# EAGLE design Protoboard (EAGLE 9.6.2)
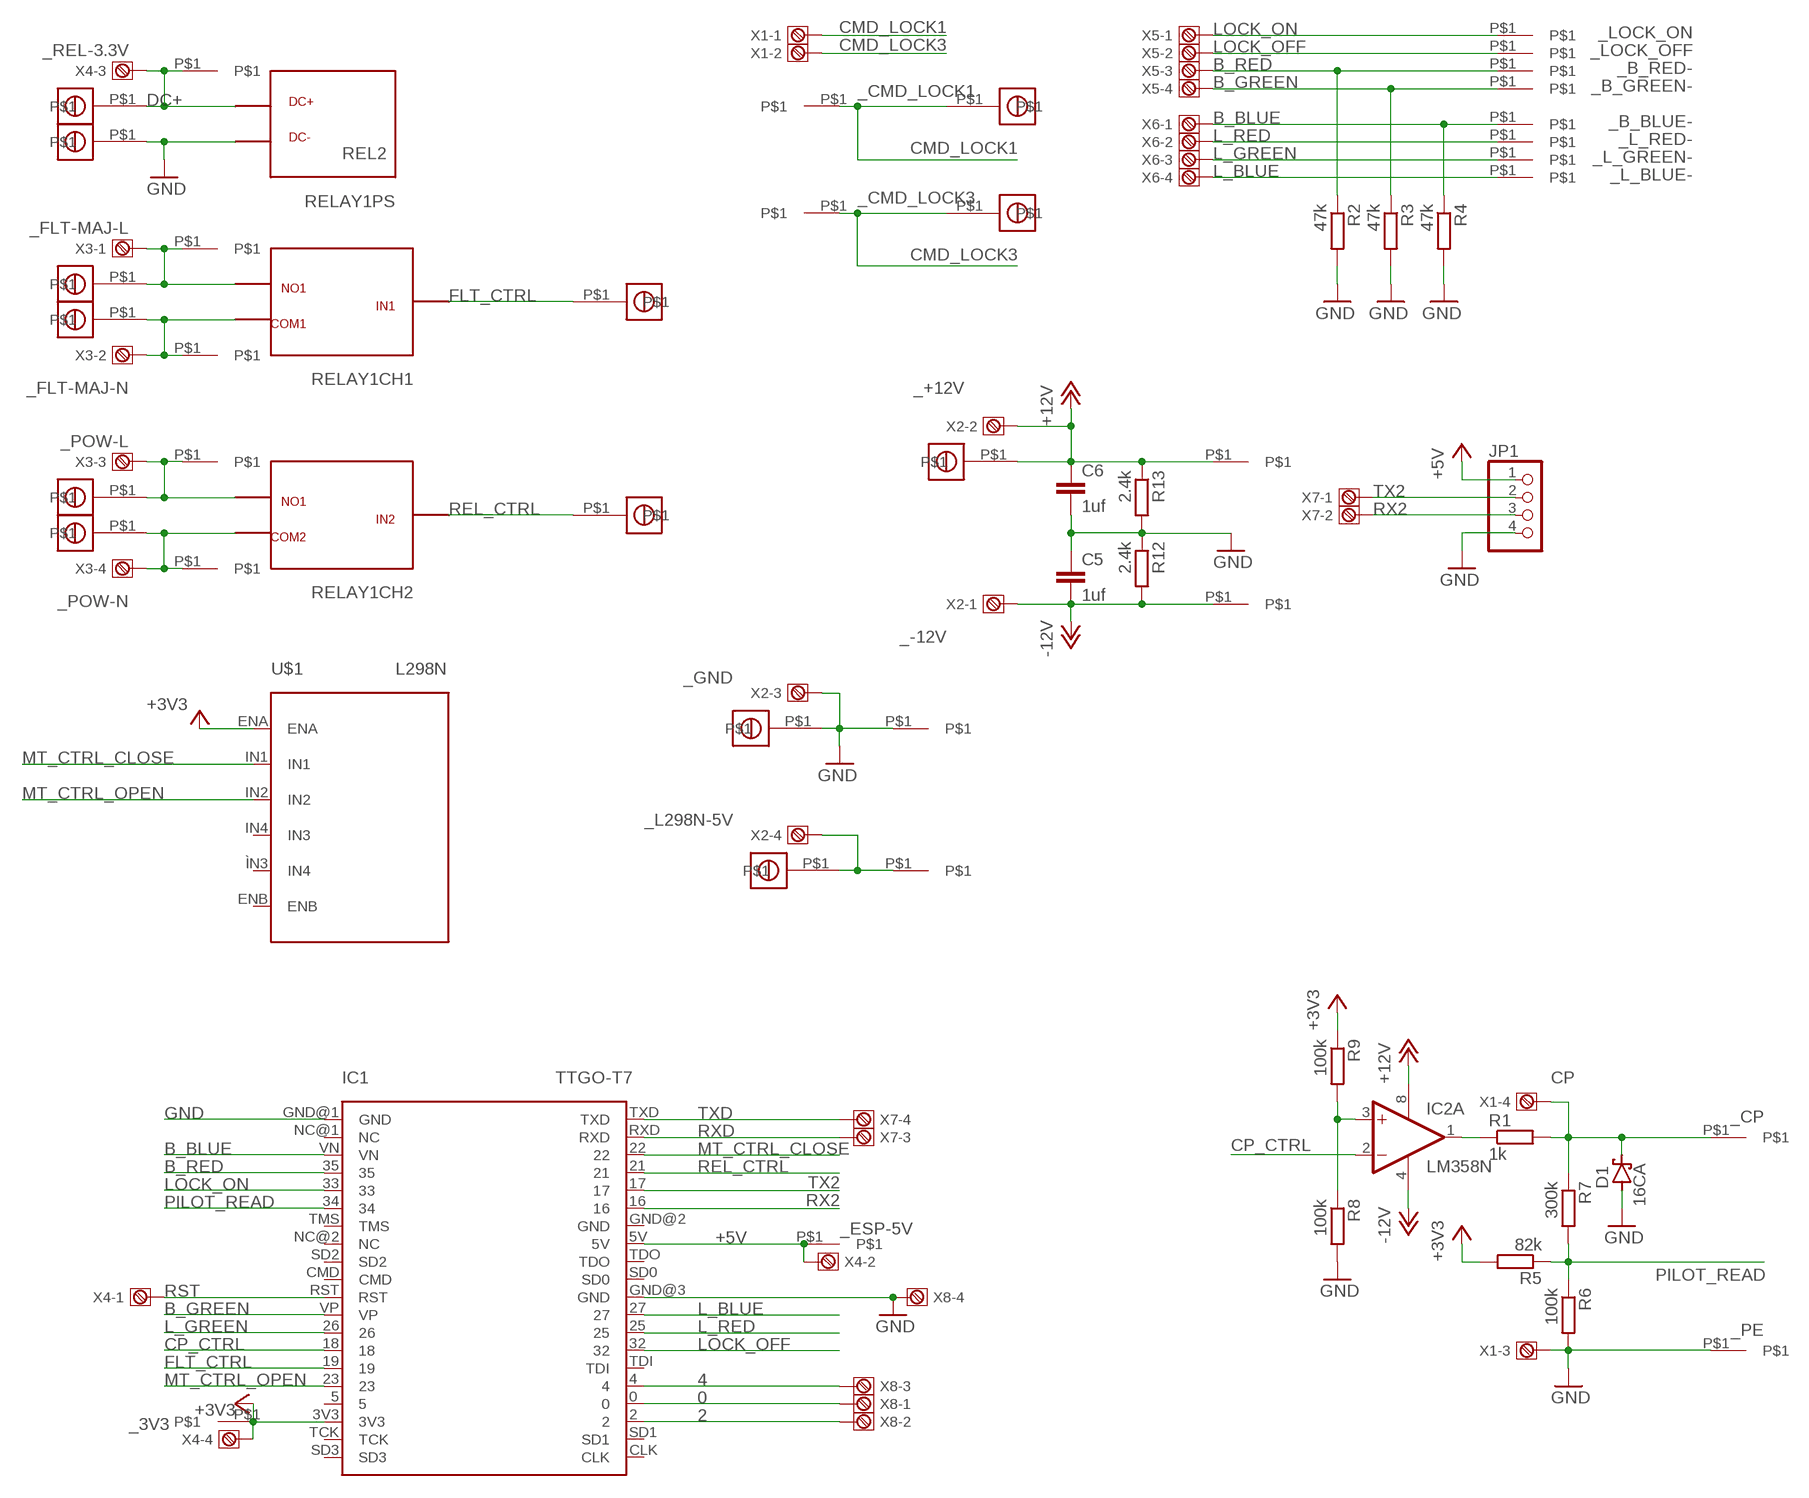
[diagram p0: schematic, sheet 1, part 1 of 2]
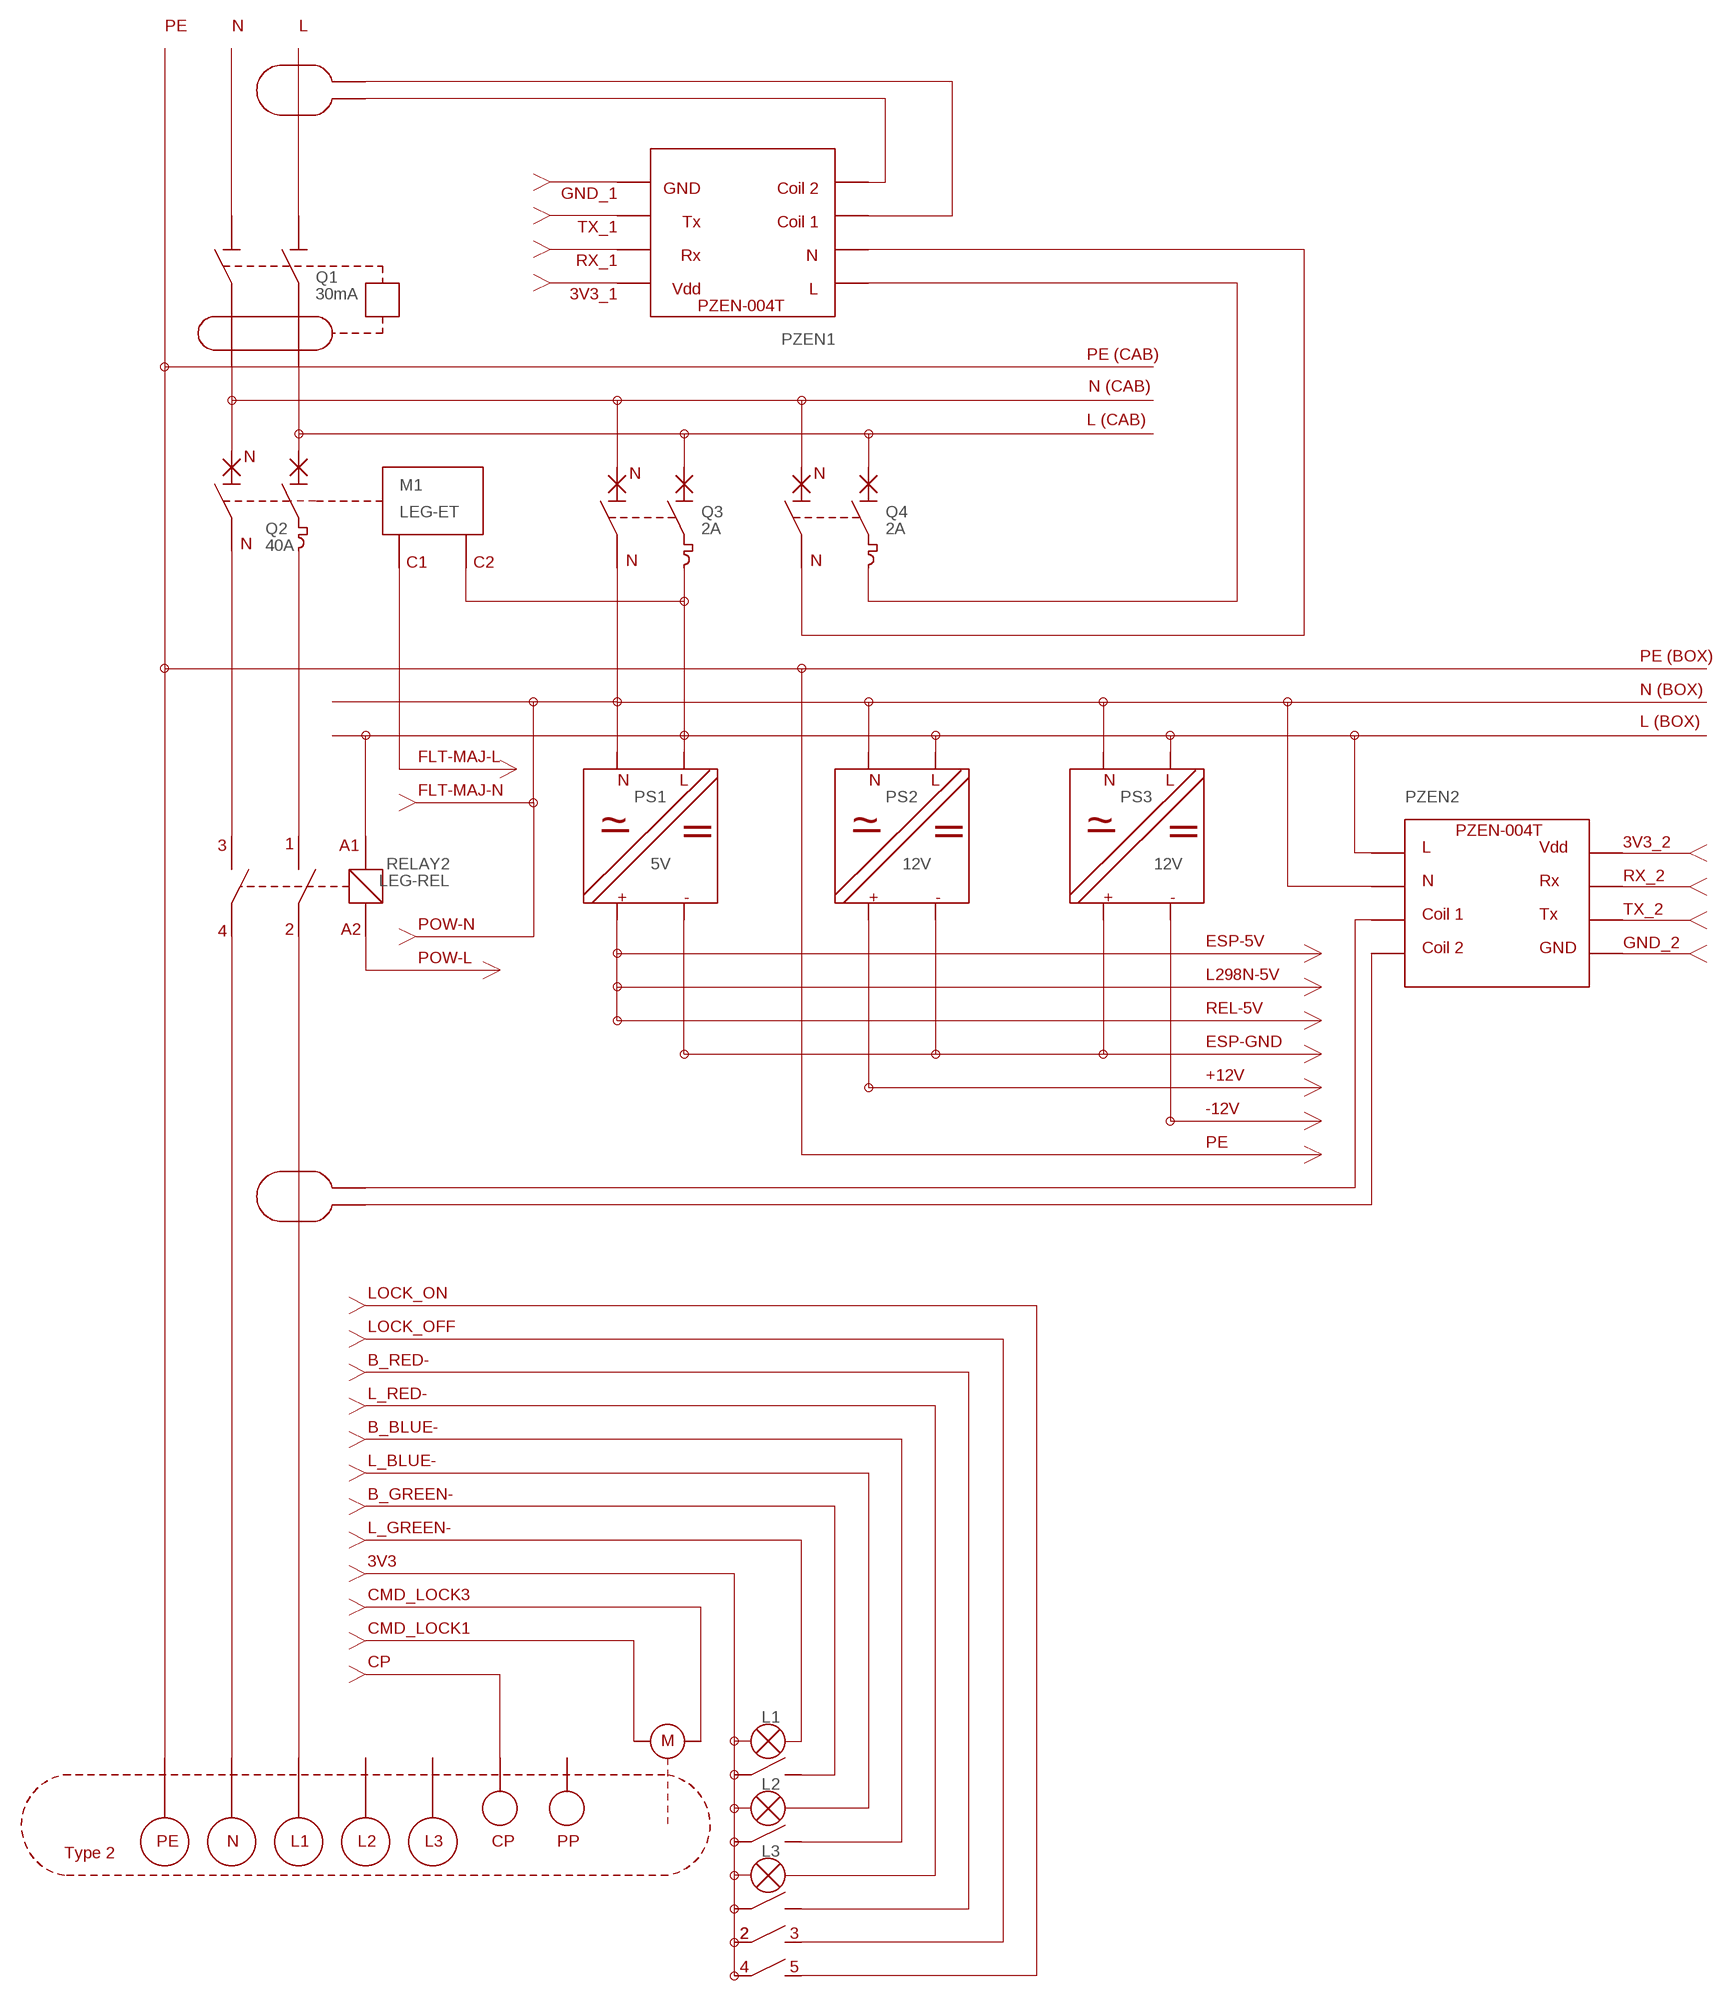
[diagram p1: schematic, sheet 1, part 2 of 2]

## Parts
5V  BORNIER  [BORNIER]
12V  BORNIER  [BORNIER]
_3V3  PIN  [PIN]
_+12V  PIN  [PIN]
_-12V  PIN  [PIN]
_B_BLUE-  PIN  [PIN]
_B_GREEN-  PIN  [PIN]
_B_RED-  PIN  [PIN]
_CMD_LOCK1  PIN  [PIN]
_CMD_LOCK3  PIN  [PIN]
_CP  PIN  [PIN]
_ESP-5V  PIN  [PIN]
_FLT-MAJ-L  PIN  [PIN]
_FLT-MAJ-N  PIN  [PIN]
_GND  PIN  [PIN]
_L298N-5V  PIN  [PIN]
_L_BLUE-  PIN  [PIN]
_L_GREEN-  PIN  [PIN]
_L_RED-  PIN  [PIN]
_LOCK_OFF  PIN  [PIN]
_LOCK_ON  PIN  [PIN]
_PE  PIN  [PIN]
_POW-L  PIN  [PIN]
_POW-N  PIN  [PIN]
_REL-3.3V  PIN  [PIN]
C5  1uf  C-EU050-025X075  [C050-025X075]
C6  1uf  C-EU050-025X075  [C050-025X075]
D1  16CA  P6KEXXA  [C1702-15]
DC+  BORNIER  [BORNIER]
DC-  BORNIER  [BORNIER]
FLT-L  BORNIER  [BORNIER]
FLT-N  BORNIER  [BORNIER]
GND  BORNIER  [BORNIER]
IC1  TTGO-T7  [TTGO-T7]
IC2  LM358N  [DIL08]
IN1  BORNIER  [BORNIER]
IN2  BORNIER  [BORNIER]
JP1  PINHD-1X4  [1X04]
MT1  BORNIER  [BORNIER]
MT2  BORNIER  [BORNIER]
POW-L  BORNIER  [BORNIER]
POW-N  BORNIER  [BORNIER]
R1  1k  R-EU_0207/10  [0207/10]
R2  47k  R-EU_0207/10  [0207/10]
R3  47k  R-EU_0207/10  [0207/10]
R4  47k  R-EU_0207/10  [0207/10]
R5  82k  R-EU_0207/10  [0207/10]
R6  100k  R-EU_0207/10  [0207/10]
R7  300k  R-EU_0207/10  [0207/10]
R8  100k  R-EU_0207/10  [0207/10]
R9  100k  R-EU_0207/10  [0207/10]
R12  2.4k  R-EU_0207/10  [0207/10]
R13  2.4k  R-EU_0207/10  [0207/10]
RELAY1  REL2  [REL2]
U$1  L298N  [L298N]
X1  1727036  [1727036]
X2  1727036  [1727036]
X3  1727036  [1727036]
X4  1727036  [1727036]
X5  1727036  [1727036]
X6  1727036  [1727036]
X7  1727036  [1727036]
X8  1727036  [1727036]

## Nets
0: IC1.0 X8.1
2: IC1.2 X8.2
4: IC1.4 X8.3
+3V3: _3V3.P$1 IC1.3V3 R5.2 R9.1 U$1.ENA X4.4
+5V: _ESP-5V.P$1 IC1.5V JP1.1 X4.2
+12V: 12V.P$1 _+12V.P$1 C6.1 IC2.8(P:V+) R13.1 X2.2
-12V: _-12V.P$1 C5.2 IC2.4(P:V-) R12.2 X2.1
B_BLUE: _B_BLUE-.P$1 IC1.VN R4.1 X6.1
B_GREEN: _B_GREEN-.P$1 IC1.VP R3.1 X5.4
B_RED: _B_RED-.P$1 IC1.35 R2.1 X5.3
CMD_LOCK1: _CMD_LOCK1.P$1 MT2.P$1 X1.2
CMD_LOCK3: _CMD_LOCK3.P$1 MT1.P$1 X1.1
CP: _CP.P$1 D1.C R1.2 R7.1 X1.4
CP_CTRL: IC1.18 IC2.2(A:-IN)
DC+: _REL-3.3V.P$1 DC+.P$1 X4.3
FLT_CTRL: IC1.19 IN1.P$1
GND: _GND.P$1 _PE.P$1 C5.1 C6.2 D1.A DC-.P$1 GND.P$1 IC1.GND@1(GND) IC1.GND@3(GND) JP1.4 R2.2 R3.2 R4.2 R6.2 R8.2 R12.1 R13.2 X1.3 X2.3 X8.4
L_BLUE: _L_BLUE-.P$1 IC1.27 X6.4
L_GREEN: _L_GREEN-.P$1 IC1.26 X6.3
L_RED: _L_RED-.P$1 IC1.25 X6.2
LOCK_OFF: _LOCK_OFF.P$1 IC1.32 X5.2
LOCK_ON: _LOCK_ON.P$1 IC1.33 X5.1
MT_CTRL_CLOSE: IC1.22 U$1.IN1
MT_CTRL_OPEN: IC1.23 U$1.IN2
N$1: _FLT-MAJ-N.P$1 FLT-N.P$1 X3.2
N$3: _FLT-MAJ-L.P$1 FLT-L.P$1 X3.1
N$4: IC2.1(A:OUT) R1.1
N$5: _POW-L.P$1 POW-L.P$1 X3.3
N$6: _POW-N.P$1 POW-N.P$1 X3.4
N$14: IC2.3(A:+IN) R8.1 R9.2
N$16: 5V.P$1 _L298N-5V.P$1 X2.4
PILOT_READ: IC1.34 R5.1 R6.1 R7.2
REL_CTRL: IC1.21 IN2.P$1
RST: IC1.RST X4.1
RX2: IC1.16 JP1.3 X7.2
RXD: IC1.RXD X7.3
TX2: IC1.17 JP1.2 X7.1
TXD: IC1.TXD X7.4
Unconnected: IC1.5 IC1.CLK IC1.CMD IC1.GND@2(GND) IC1.NC@1(NC) IC1.NC@2(NC) IC1.SD0 IC1.SD1 IC1.SD2 IC1.SD3 IC1.TCK IC1.TDI IC1.TDO IC1.TMS IC2.5(B:+IN) IC2.6(B:-IN) IC2.7(B:OUT) U$1.ENB U$1.IN4(IN3) U$1.ÌN3(IN4)

## Notes on the sheet
- PE | N | L
- GND_1
- TX_1
- RX_1
- 3V3_1
- PE (CAB)
- N (CAB)
- L (CAB)
- PE (BOX)
- N (BOX)
- L (BOX)
- FLT-MAJ-L
- FLT-MAJ-N
- 3V3_2
- RX_2
- TX_2
- POW-N
- ESP-5V | GND_2
- POW-L
- L298N-5V
- REL-5V
- ESP-GND
- +12V
- -12V
- PE
- LOCK_ON
- LOCK_OFF
- B_RED-
- L_RED-
- B_BLUE-
- L_BLUE-
- B_GREEN-
- L_GREEN-
- 3V3
- CMD_LOCK3
- CMD_LOCK1
- CP
- 2 | 2 | 3
- 4 | 5

## Library data of the parts
5V 12V DC+ DC- FLT-L FLT-N GND IN1 IN2 MT1 MT2 POW-L POW-N = bornier:BORNIER
_3V3 _+12V _-12V _B_BLUE- _B_GREEN- _B_RED- _CMD_LOCK1 _CMD_LOCK3 _CP _ESP-5V _FLT-MAJ-L _FLT-MAJ-N _GND _L298N-5V _L_BLUE- _L_GREEN- _L_RED- _LOCK_OFF _LOCK_ON _PE _POW-L _POW-N _REL-3.3V = PIN:PIN
C5 C6 = rcl:C-EU: CAPACITOR, European symbol; SPICEPREFIX: C
D1 = diode:P6KEXXA: DIODE transient-voltage suppressor
IC1 = TTGO T7:TTGO-T7: TTGO-T7 V1.4
IC2 = linear:LM358: OP AMP also LM158; LM258; LM2904 Source: http://cache.national.com/ds/LM/LM158.pdf
JP1 = pinhead:PINHD-1X4: PIN HEADER
R1-R9 R12 R13 = rcl:R-EU_: RESISTOR, European symbol; SPICEPREFIX: R
RELAY1 = REL2:REL2: REL2
U$1 = L298N:L298N: L298N
X1-X8 = con-phoenix-3.81:1727036: MKDS 1/4-3,81 Source: http://eshop.phoenixcontact.de; MF: FARNELL; MPN: 1727036; OC_FARNELL: 3704592; OC_NEWARK: 71C4114

## Board
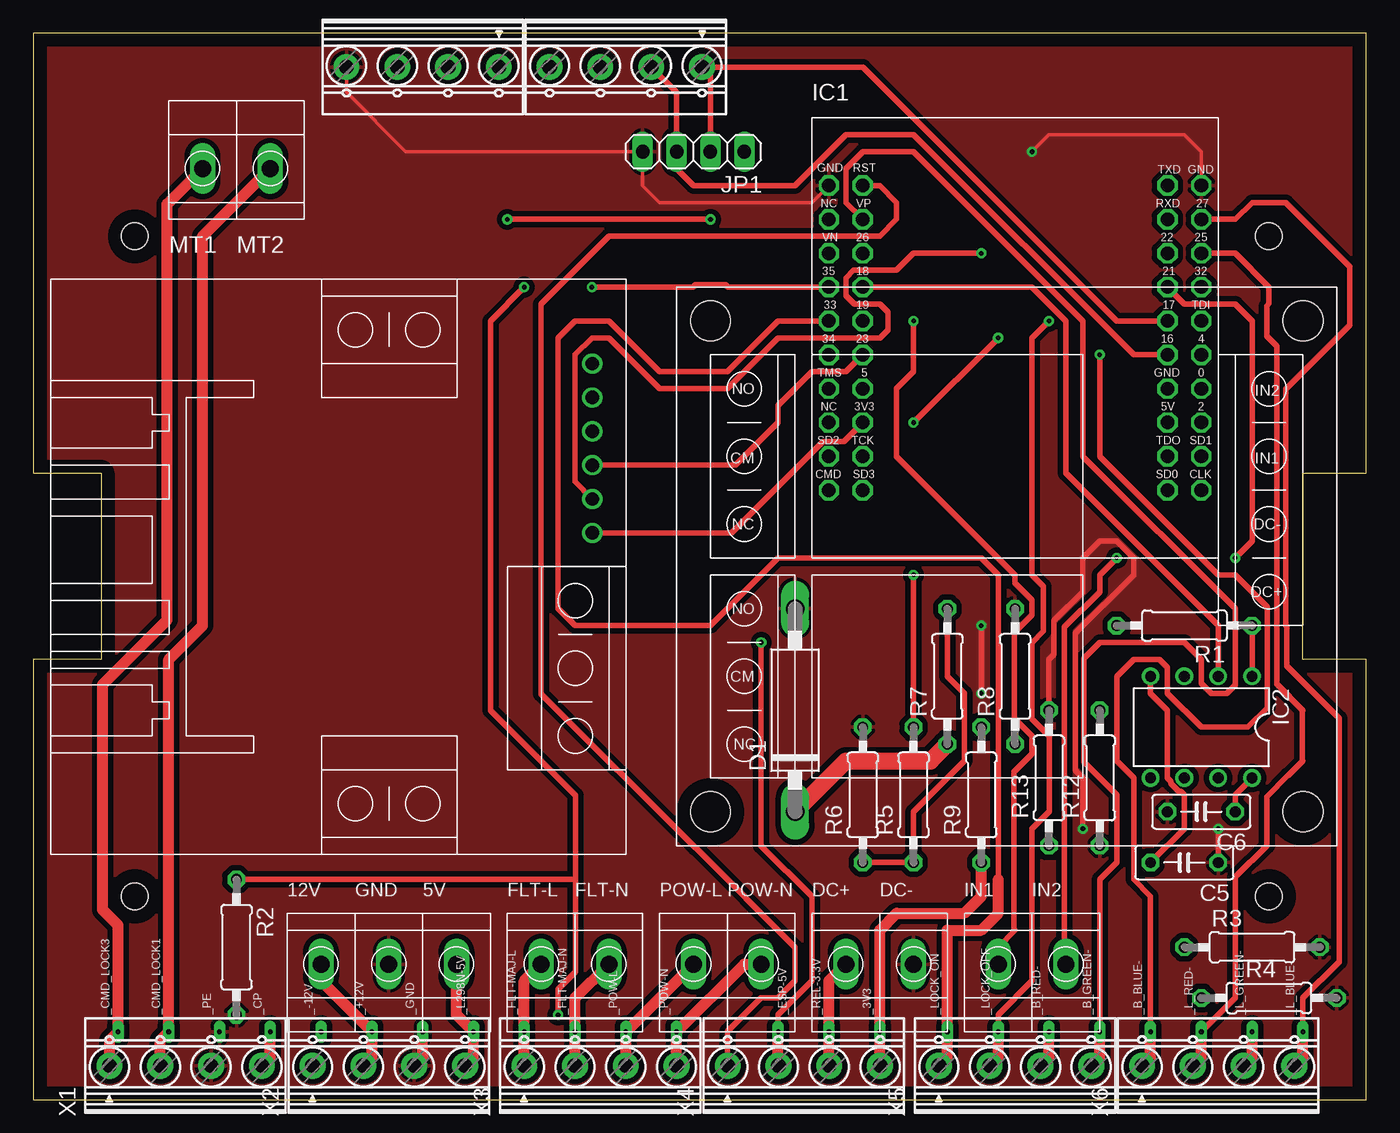
[diagram p2: board, top side]
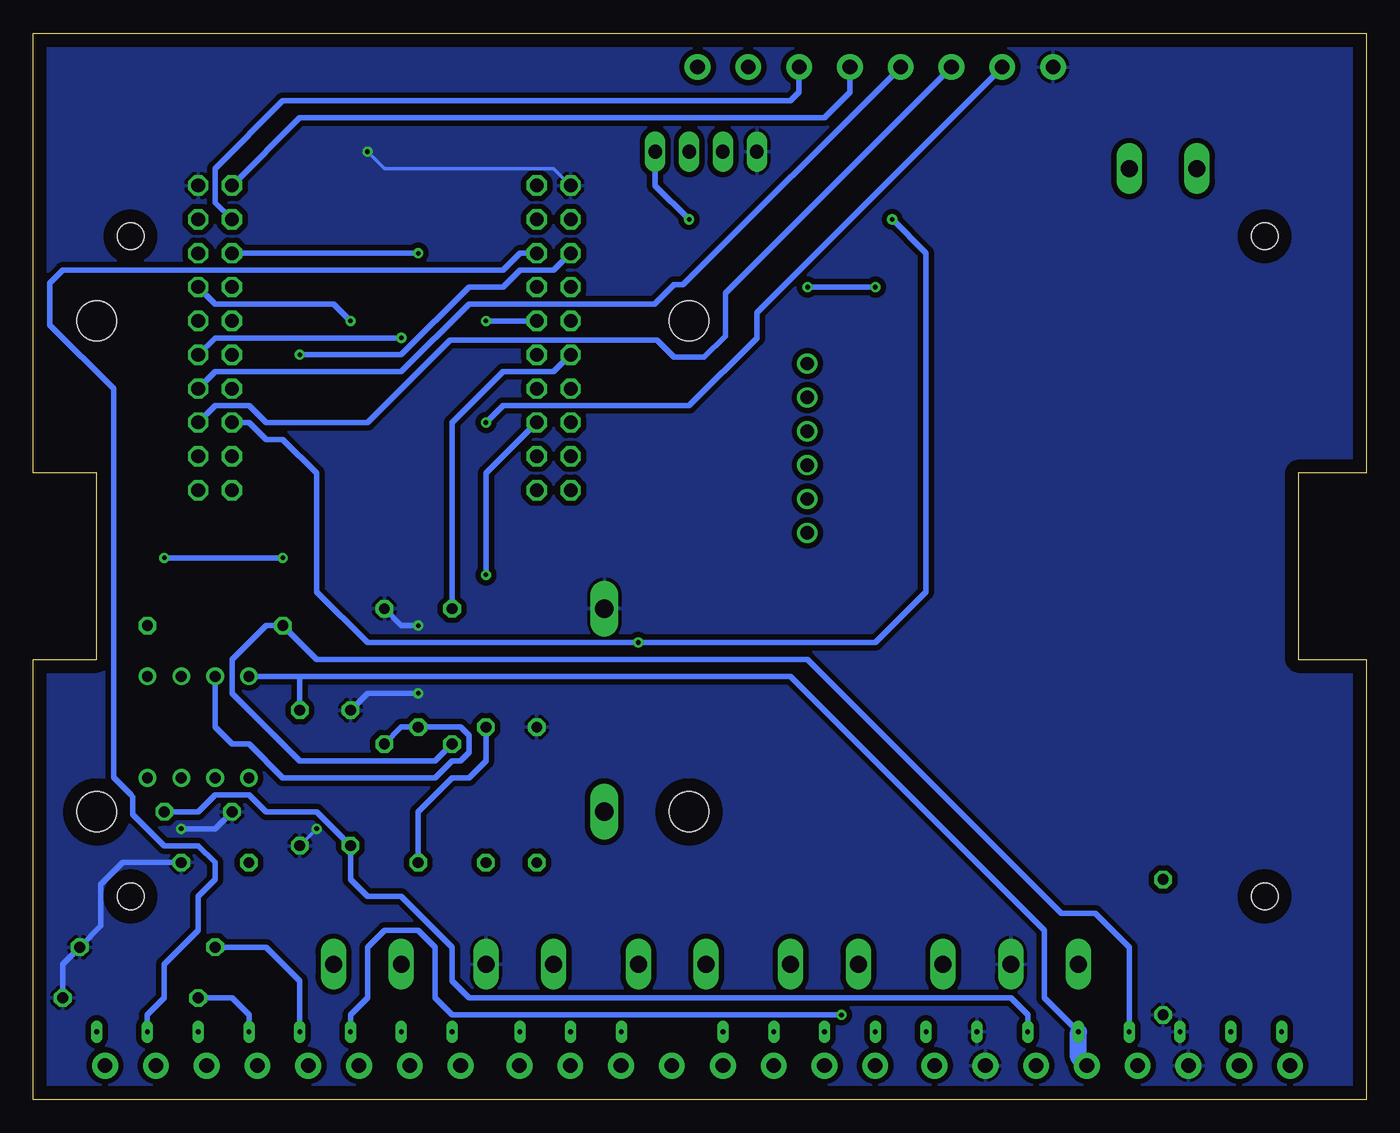
[diagram p3: board, bottom side, seen from below]

Size 100 x 80 mm. Coordinates in mm from the lower left corner, seen from the top.
Outline: 100,80 100,46.99 95.25,46.99 95.25,33.02 100,33.02 100,0 0,0 0,33.02 5.08,33.02 5.08,46.99 0,46.99 0,80 100,80
Outline: 100,80 100,80
Copper layers (1*16): Top 0.035mm / dielectric 1.5mm / Bottom 0.035mm
Design rules "default": minimum track width 6mil, minimum drill 0.35mm, track to track 6mil, track to pad 6mil, pad to pad 6mil, via to via 6mil, smd to smd 6mil, copper to edge 40mil, drill to drill 6mil, minimum pad ring 10mil, minimum via ring 8mil, stop-mask expansion 4mil, vias tented up to drill 0mil, thermal gap 10mil
Holes 2 mm at 7.62,15.24 92.71,15.24 7.62,64.77 92.71,64.77

### Footprints (pad centres in the part's own frame; a part is rotated, then mirrored left to right if it is on the bottom)
BORNIER = drill 1.27 long: P$1 0,0
PIN = drill 0.35 long: P$1 0,0
C050-025X075 = drill 0.813 octagon: 1 -2.54,0; 2 2.54,0
C1702-15 = drill 1.397 long: A 7.62,0; C -7.62,0
TTGO-T7 = drill 1.016 pad 1.524 octagon: 0 27.94,7.62; 2 27.94,5.08; 3V3 2.54,5.08; 4 27.94,10.16; 5 2.54,7.62; 5V 25.4,5.08; 16 25.4,10.16; 17 25.4,12.7; 18 2.54,15.24; 19 2.54,12.7; 21 25.4,15.24; 22 25.4,17.78; 23 2.54,10.16; 25 27.94,17.78; 26 2.54,17.78; 27 27.94,20.32; 32 27.94,15.24; 33 0,12.7; 34 0,10.16; 35 0,15.24; CLK 27.94,0; CMD 0,0; GND@1 0,22.86; GND@2 25.4,7.62; GND@3 27.94,22.86; NC@1 0,20.32; NC@2 0,5.08; RST 2.54,22.86; RXD 25.4,20.32; SD0 25.4,0; SD1 27.94,2.54; SD2 0,2.54; SD3 2.54,0; TCK 2.54,2.54; TDI 27.94,12.7; TDO 25.4,2.54; TMS 0,7.62; TXD 25.4,22.86; VN 0,17.78; VP 2.54,20.32
DIL08 = drill 0.813 pad 1.27: 1 -3.81,-3.81; 2 -1.27,-3.81; 3 1.27,-3.81; 4 3.81,-3.81; 5 3.81,3.81; 6 1.27,3.81; 7 -1.27,3.81; 8 -3.81,3.81
1X04 = drill 1.016 long: 1 -3.81,0; 2 -1.27,0; 3 1.27,0; 4 3.81,0
0207/10 = drill 0.813 octagon: 1 -5.08,0; 2 5.08,0
REL2 = hole 3: 46.99,2.54; 46.99,39.37; 2.54,39.37; 2.54,2.54
L298N = drill 1: ENA 2.54,19.05; ENB 2.54,6.35; IN1 2.54,16.51; IN2 2.54,13.97; IN4 2.54,8.89; ÌN3 2.54,11.43
1727036 = drill 1.1 pad 1.93: 1 -5.715,0; 2 -1.905,0; 3 1.905,0; 4 5.715,0

### Placement (x,y rotation side)
5V  31.75,10.16 180 top
12V  21.59,10.16 180 top
_3V3  63.5,5.08 90 top
_+12V  25.4,5.08 90 top
_-12V  21.59,5.08 90 top
_B_BLUE-  83.82,5.08 90 top
_B_GREEN-  80.01,5.08 90 top
_B_RED-  76.2,5.08 90 top
_CMD_LOCK1  10.16,5.08 90 top
_CMD_LOCK3  6.35,5.08 90 top
_CP  17.78,5.08 90 top
_ESP-5V  55.88,5.08 90 top
_FLT-MAJ-L  36.83,5.08 90 top
_FLT-MAJ-N  40.64,5.08 90 top
_GND  29.21,5.08 90 top
_L298N-5V  33.02,5.08 90 top
_L_BLUE-  95.25,5.08 90 top
_L_GREEN-  91.44,5.08 90 top
_L_RED-  87.63,5.08 90 top
_LOCK_OFF  72.39,5.08 90 top
_LOCK_ON  68.58,5.08 90 top
_PE  13.97,5.08 90 top
_POW-L  44.45,5.08 90 top
_POW-N  48.26,5.08 90 top
_REL-3.3V  59.69,5.08 90 top
C5  86.36,17.78 180 top
C6  87.63,21.59 180 top
D1  57.15,29.21 90 top
DC+  60.96,10.16 180 top
DC-  66.04,10.16 180 top
FLT-L  38.1,10.16 180 top
FLT-N  43.18,10.16 180 top
GND  26.67,10.16 180 top
IC1  59.69,45.72 0 top
IC2  87.63,27.94 180 top
IN1  72.39,10.16 180 top
IN2  77.47,10.16 180 top
JP1  49.53,71.12 180 top
MT1  12.7,69.85 0 top
MT2  17.78,69.85 0 top
POW-L  49.53,10.16 180 top
POW-N  54.61,10.16 180 top
R1  86.36,35.56 180 top
R2  15.24,11.43 270 top
R3  91.44,11.43 0 top
R4  92.71,7.62 0 top
R5  66.04,22.86 90 top
R6  62.23,22.86 90 top
R7  68.58,31.75 90 top
R8  73.66,31.75 90 top
R9  71.12,22.86 90 top
R12  80.01,24.13 90 top
R13  76.2,24.13 90 top
RELAY1  97.79,60.96 180 top
U$1  44.48,61.57 180 top
X1  11.43,2.54 0 top
X2  26.67,2.54 0 top
X3  42.55,2.54 0 top
X4  57.81,2.54 0 top
X5  73.66,2.54 0 top
X6  88.9,2.54 0 top
X7  44.45,77.47 180 top
X8  29.21,77.47 180 top

### Tracks (layer width: path | path; a pad name or v marks a point on that pad's centre or on a via)
0
  Bottom 0.406: X8.1 51.26,61.14 51.93,61.14 53.38,59.69 67.31,59.69 72.39,54.61 86.36,54.61 IC1.0
2
  Bottom 0.406: X8.2 48.08,60.5 48.08,57.29 49.67,55.7 51.93,55.7 53.22,57 68.73,57 74.93,50.8 82.55,50.8 83.82,52.07 86.36,52.07 IC1.2
4  (via drill 0.35)
  Top 0.406: v66.04,50.8 v72.39,57.15
  Bottom 0.406: X8.3 45.72,59.05 45.72,57.15 50.8,52.07 64.77,52.07 v66.04,50.8 | IC1.4 86.36,57.15 v72.39,57.15
+3V3  (via drill 0.35)
  Top 0.406: IC1.3V3 60.81,49.38 59.23,49.38 52.37,42.52 U$1.ENA | R5.2 v66.04,39.37
  Top 0.813: X4.4 63.5,2.56 _3V3.P$1 63.5,12.7 64.77,13.97 69.85,13.97 71.12,15.24 R9.1
  Bottom 0.406: R5.2 66.04,25.4 67.31,24.13 68.58,24.13 71.12,21.59 R9.1 | IC1.3V3 66.04,46.99 v66.04,39.37
+5V  (via drill 0.35)
  Top 0.406: _ESP-5V.P$1 55.88,6.35 58.42,8.89 58.42,15.24 54.61,19.05 v54.61,34.29 | v50.8,66.04 v35.56,66.04
  Top 0.813: 55.88,2.56 _ESP-5V.P$1
  Top 1.27: X4.2 55.88,2.56
  Bottom 0.406: IC1.5V 83.82,50.8 82.55,49.53 81.28,49.53 78.74,46.99 78.74,38.1 74.93,34.29 v54.61,34.29 36.83,34.29 33.02,38.1 33.02,63.5 v35.56,66.04 | JP1.1 53.34,68.58 v50.8,66.04
+12V
  Top 0.406: C6.1 90.17,22.86 IC2.8
  Top 0.813: X2.2 25.4,3.17 _+12V.P$1 21.59,8.89 12V.P$1
  Bottom 0.406: _+12V.P$1 25.4,6.35 26.67,7.62 67.31,7.62 68.58,8.89 68.58,11.43 72.39,15.24 74.93,15.24 76.2,16.51 R13.1 78.74,21.59 82.55,21.59 83.82,22.86 86.36,22.86 87.63,21.59 C6.1
-12V
  Top 0.406: IC2.4 83.82,30.48 85.09,29.21 85.09,24.13 85.34,23.88 85.34,23.71 85.94,23.11 86.11,23.11 86.36,22.86 86.36,20.32 C5.2
  Bottom 0.406: _-12V.P$1 24.13,7.62 24.13,12.7 43.18,31.75 80.01,31.75 | 80.01,31.75 IC2.4 | R12.2 80.01,31.75
  Bottom 1.27: X2.1 21.59,3.17 _-12V.P$1
B_BLUE  (via drill 0.35)
  Top 0.406: _B_BLUE-.P$1 83.82,15.24 82.55,16.51 82.55,24.13 81.28,25.4 81.28,31.75 82.55,33.02 84.48,33.02 85.09,32.41 85.09,30.48 87.63,27.94 91.14,27.94 92.58,29.39 92.58,36.96 90.17,39.37 88.9,39.37 80.01,48.26 v80.01,55.88
  Top 0.813: X6.1 83.82,3.17 _B_BLUE-.P$1
  Bottom 0.406: v80.01,55.88 72.39,55.88 67.31,60.96 64.77,60.96 63.5,62.23 60.96,62.23 IC1.VN | R4.1 85.09,7.62 83.82,6.35 _B_BLUE-.P$1
B_GREEN
  Top 0.406: _B_GREEN-.P$1 80.01,16.51 81.28,17.78 81.28,22.86 78.82,25.32 78.82,33.1 80.01,34.29 86.36,34.29 87.63,33.02 87.63,31.22 88.37,30.48 89.56,30.48 90.17,31.09 90.17,36.83 78.74,48.26 78.74,58.42 66.04,71.12 62.23,71.12 60.96,69.85 60.96,67.31 IC1.VP
  Top 0.813: X5.4 80.01,3.17 _B_GREEN-.P$1
  Bottom 0.406: R3.1 82.55,11.43 80.01,8.89 _B_GREEN-.P$1
B_RED  (via drill 0.35)
  Top 0.406: IC1.35 52.11,60.96 51.93,61.14 49.67,61.14 49.49,60.96 v41.91,60.96 | 40.66,16.51 40.66,9.58 39.37,8.28 v39.37,6.35 | 40.66,16.51 40.66,22.84 34.29,29.21 34.29,58.42 v36.83,60.96 | R2.1 40.66,16.51
  Top 0.813: X5.3 76.2,3.17 _B_RED-.P$1
  Bottom 0.406: _B_RED-.P$1 76.2,6.35 74.93,7.62 74.93,11.43 73.66,12.7 71.12,12.7 69.85,11.43 69.85,7.62 68.58,6.35 v39.37,6.35 | v41.91,60.96 v36.83,60.96
CMD_LOCK1
  Top 0.813: X1.2 9.53,4.45 _CMD_LOCK1.P$1 10.16,33.02 12.7,35.56 12.7,64.77 MT2.P$1
CMD_LOCK3
  Top 0.813: X1.1 5.71,4.45 _CMD_LOCK3.P$1 6.35,13.09 5.2,14.24 5.2,31.13 10.04,35.97 10.04,67.19 MT1.P$1
CP
  Top 0.813: X1.4 17.78,3.17 _CP.P$1
  Top 1.27: D1.C 60.96,25.4 67.31,25.4 R7.1
  Bottom 0.406: _CP.P$1 17.78,11.43 20.32,13.97 22.86,13.97 41.91,33.02 78.74,33.02 R1.2 82.55,35.56 85.09,33.02 85.09,30.48 80.01,25.4 69.85,25.4 R7.1
CP_CTRL
  Top 0.406: IC2.2 88.9,35.56 77.47,46.99 77.47,58.42 74.93,60.96 IC1.18
DC+
  Top 0.813: X4.3 59.69,2.56 _REL-3.3V.P$1 59.69,8.89 DC+.P$1
FLT_CTRL  (via drill 0.35)
  Top 0.406: v66.04,58.42 66.04,54.61 64.77,53.34 64.77,48.26 73.66,39.37 73.66,38.76 74.93,37.49 74.93,36.35 73.66,35.08 73.61,35.08 73.61,28.6 74.93,27.28 74.93,25.93 73.58,24.59 73.58,12.78 73.66,12.7 72.39,11.43 IN1.P$1
  Bottom 0.406: IC1.19 v66.04,58.42
GND  (via drill 0.35)
  Top 0.254: IC1.GND@1 58.42,67.31 46.99,67.31 45.72,68.58 JP1.4 27.94,71.12 23.5,75.56 X8.4 | IC1.GND@3 87.63,71.12 86.36,72.39 76.2,72.39 v74.93,71.12
  Top 0.406: v71.12,35.56 v71.12,30.48 | v78.74,20.32 78.74,24.13 78.18,24.69 78.18,35 82.55,39.37 82.55,40.64 81.28,41.91 80.01,41.91 78.74,40.64 78.74,38.1 76.58,35.94 76.58,33.4 76.2,33.02 R13.2 | v88.9,20.32 C5.1
  Top 0.813: X2.3 29.21,3.17 _GND.P$1
  Bottom 0.254: v74.93,71.12 73.66,69.85 60.96,69.85 IC1.GND@1 | R12.1 v78.74,20.32
  Bottom 0.406: R8.2 72.39,35.56 v71.12,35.56 | v71.12,30.48 74.93,30.48 R13.2 | R4.2 97.79,10.16 R3.2 94.93,13.02 94.93,16.16 93.31,17.78 C5.1 | C6.2 86.36,20.32 v88.9,20.32
  pour Top (isolate 0.406): 0,0 0,33.02 5.08,33.02 5.08,46.99 0,46.99 0,80.01 100,80.01 100,47.02 99.97,46.99 95.25,46.99 95.25,33.02 100,33.02 100,0
  pour Bottom (isolate 0.406): 0,0 0,33.02 5.08,33.02 5.08,46.99 0,46.99 0,80.01 100,80.01 100,46.99 95.25,46.99 95.25,33.02 100,33.02 100,0
L_BLUE
  Top 0.406: IC1.27 90.17,66.04 91.44,67.31 93.98,67.31 98.78,62.51 98.78,58.1 93.98,53.3 93.98,35.56 94.03,35.51 94.03,32.52 97.97,28.58 97.97,10.34 95.25,7.62 _L_BLUE-.P$1
  Top 0.813: X6.4 95.25,3.17 _L_BLUE-.P$1
L_GREEN
  Top 0.813: X6.3 91.44,3.17 _L_GREEN-.P$1
  Bottom 0.406: IC1.26 63.5,63.5 64.77,62.23 97.79,62.23 98.78,61.24 98.78,58.1 96.38,55.7 96.34,55.7 93.98,53.34 93.98,24.17 92.69,22.88 92.53,22.72 92.53,21.41 90.17,19.05 87.63,19.05 86.36,17.78 86.36,16.51 87.63,15.24 87.63,12.7 90.17,10.16 90.17,7.62 91.44,6.35 _L_GREEN-.P$1
L_RED
  Top 0.406: IC1.25 90.17,63.5 92.71,60.96 92.71,59.73 92.53,59.55 92.53,57.29 93.29,56.53 93.29,31.17 95.25,29.21 95.21,29.17 95.21,25.4 95.25,25.4 94.16,24.31 94.12,24.31 92.53,22.72 92.53,19.05 90.17,16.69 90.17,7.62 _L_RED-.P$1
  Top 0.813: X6.2 87.63,3.17 _L_RED-.P$1
LOCK_OFF  (via drill 0.35)
  Top 0.406: _LOCK_OFF.P$1 72.39,6.35 74.93,8.89 74.93,20.32 76.22,21.61 76.22,27.23 74.91,28.55 74.91,34.27 75.79,35.15 75.79,38.51 74.93,39.37 74.93,57.15 v76.2,58.42
  Top 0.813: X5.2 72.39,3.17 _LOCK_OFF.P$1
  Bottom 0.406: v76.2,58.42 77.47,59.69 86.36,59.69 IC1.32
LOCK_ON
  Top 0.406: 72.39,16.51 72.39,39.37 71.12,40.64 55.88,40.64 50.8,35.56 40.64,35.56 39.37,36.83 39.37,57.15 40.64,58.42 43.18,58.42 46.99,54.61 52.07,54.61 55.88,58.42 IC1.33
  Top 0.813: X5.1 68.58,3.17 _LOCK_ON.P$1 68.58,12.7 71.12,12.7 72.39,13.97 72.39,16.51
MT_CTRL_CLOSE  (via drill 0.35)
  Top 0.406: U$1.IN1 40.64,46.35 40.64,55.88 41.91,57.15 43.18,57.15 46.99,53.34 52.07,53.34 55.88,57.15 63.52,57.15 64.11,57.73 64.11,59.08 63.5,59.69 61.59,59.69 60.96,60.33 60.96,61.65 61.54,62.23 64.77,62.23 66.04,63.5 v71.12,63.5
  Bottom 0.406: v71.12,63.5 IC1.22
MT_CTRL_OPEN
  Top 0.406: U$1.IN2 52.68,47.6 55.88,50.8 55.88,52.07 58.42,54.61 60.96,54.61 IC1.23
N$1
  Top 0.813: X3.2 _FLT-MAJ-N.P$1 40.64,7.62 FLT-N.P$1
N$3
  Top 0.813: X3.1 _FLT-MAJ-L.P$1 36.83,8.89 FLT-L.P$1
N$4
  Top 0.406: IC2.1 R1.1
N$5
  Top 0.813: X3.3 _POW-L.P$1 POW-L.P$1
N$6
  Top 0.813: X3.4 _POW-N.P$1 53.34,10.16 POW-N.P$1
N$14
  Bottom 0.406: R8.1 72.39,27.94 R9.2 67.94,27.94 67.31,27.3 67.31,26.04 67.94,25.4 68.58,25.4 69.85,24.13 81.28,24.13 83.82,26.67 85.09,26.67 86.36,27.94 IC2.3
N$16
  Top 0.813: X2.4 33.02,3.17 _L298N-5V.P$1 31.75,6.35 5V.P$1
PILOT_READ
  Top 0.406: R6.1 R5.1 66.04,21.59 69.85,25.4 69.85,30.48 68.58,31.75 R7.2
  Bottom 0.406: R7.2 68.58,50.8 64.77,54.61 60.96,54.61 IC1.34
REL_CTRL  (via drill 0.35)
  Top 0.406: IC1.21 86.36,59.69 90.17,59.69 91.44,58.42 91.44,41.91 v90.17,40.64 | IN2.P$1 77.37,10.26 77.37,35.46 80.01,38.1 80.01,39.37 v81.28,40.64
  Bottom 0.406: v90.17,40.64 v81.28,40.64
RST
  Top 0.406: X4.1 52.09,5.11 54.61,7.62 55.88,7.62 57.15,8.89 57.15,11.43 49.71,18.87 49.67,18.87 38.1,30.44 38.1,59.69 43.18,64.77 63.5,64.77 64.77,66.04 64.77,67.31 63.5,68.58 IC1.RST
RX2
  Top 0.406: X7.2 48.26,75.56 JP1.3 48.26,69.85 49.53,68.58 57.15,68.58 60.96,72.39 66.04,72.39 82.55,55.88 IC1.16
RXD
  Bottom 0.406: IC1.RXD 86.36,67.31 86.36,69.85 81.28,74.93 43.18,74.93 42.55,75.56 X7.3
TX2
  Top 0.406: JP1.2 50.8,76.83 X7.1 62.23,77.47 81.28,58.42 IC1.17
TXD
  Bottom 0.406: IC1.TXD 80.01,73.66 40.64,73.66 38.73,75.56 X7.4